# EAGLE design opamp_swing (EAGLE 6.2)
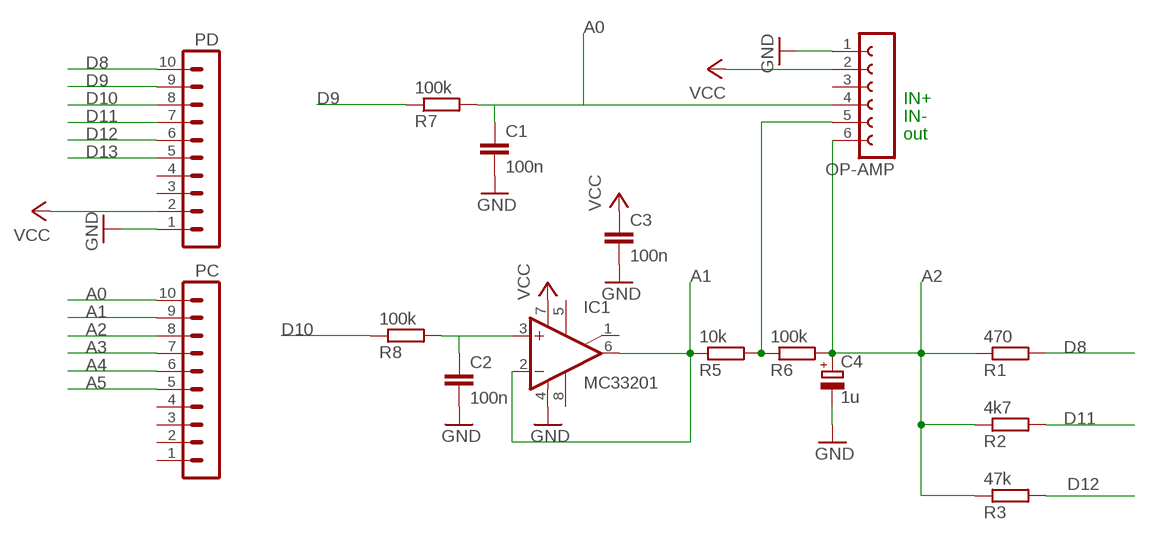
[diagram p0: schematic, sheet 1]

## Parts
C1  100n  C-EU050-025X075  [C050-025X075]
C2  100n  C-EU025-024X044  [C025-024X044]
C3  100n  C-EU025-024X044  [C025-024X044]
C4  1u  CPOL-EU153CLV-0405  [153CLV-0405]
IC1  MC33201  CA3130N  [DIL08]
OP-AMP  FE06W  [FE06W]
PC  MA10-1W  [MA10-1W]
PD  MA10-1W  [MA10-1W]
R1  470  R-EU_R1206  [R1206]
R2  4k7  R-EU_R1206  [R1206]
R3  47k  R-EU_R1206  [R1206]
R5  10k  R-EU_0207/12  [0207/12]
R6  100k  R-EU_0207/2V  [0207/2V]
R7  100k  R-EU_0207/15  [0207/15]
R8  100k  R-EU_0207/15  [0207/15]

## Nets
A0: C1.1 OP-AMP.4 PC.10 R7.2
A1: IC1.2(-IN) IC1.6(OUT) PC.9 R5.1
A2: C4.+ OP-AMP.6 PC.8 R1.1 R2.1 R3.1 R6.2
A3: PC.7
A4: PC.6
A5: PC.5
D8: PD.10 R1.2
D9: PD.9 R7.1
D10: PD.8 R8.1
D11: PD.7 R2.2
D12: PD.6 R3.2
D13: PD.5
GND: C1.2 C2.2 C3.2 C4.- IC1.4(V-) OP-AMP.1 PD.1
N$1: C2.1 IC1.3(+IN) R8.2
N$2: OP-AMP.5 R5.2 R6.1
VCC: C3.1 IC1.7(V+) OP-AMP.2 PD.2
Unconnected: IC1.1(ON/CMP) IC1.5(ON) IC1.8(CMP) OP-AMP.3 PC.1 PC.2 PC.3 PC.4 PD.3 PD.4

## Notes on the sheet
- IN+
- IN-
- out

## Library data of the parts
C1-C3 = rcl:C-EU: CAPACITOR, European symbol
C4 = rcl:CPOL-EU: POLARIZED CAPACITOR, European symbol
IC1 = linear:CA3130: OP AMP
OP-AMP = con-lsta:FE06W: FEMALE HEADER; OC_FARNELL: unknown; OC_NEWARK: unknown
PC PD = con-lstb:MA10-1W: PIN HEADER
R1-R3 R5-R8 = rcl:R-EU_: RESISTOR, European symbol

## Board
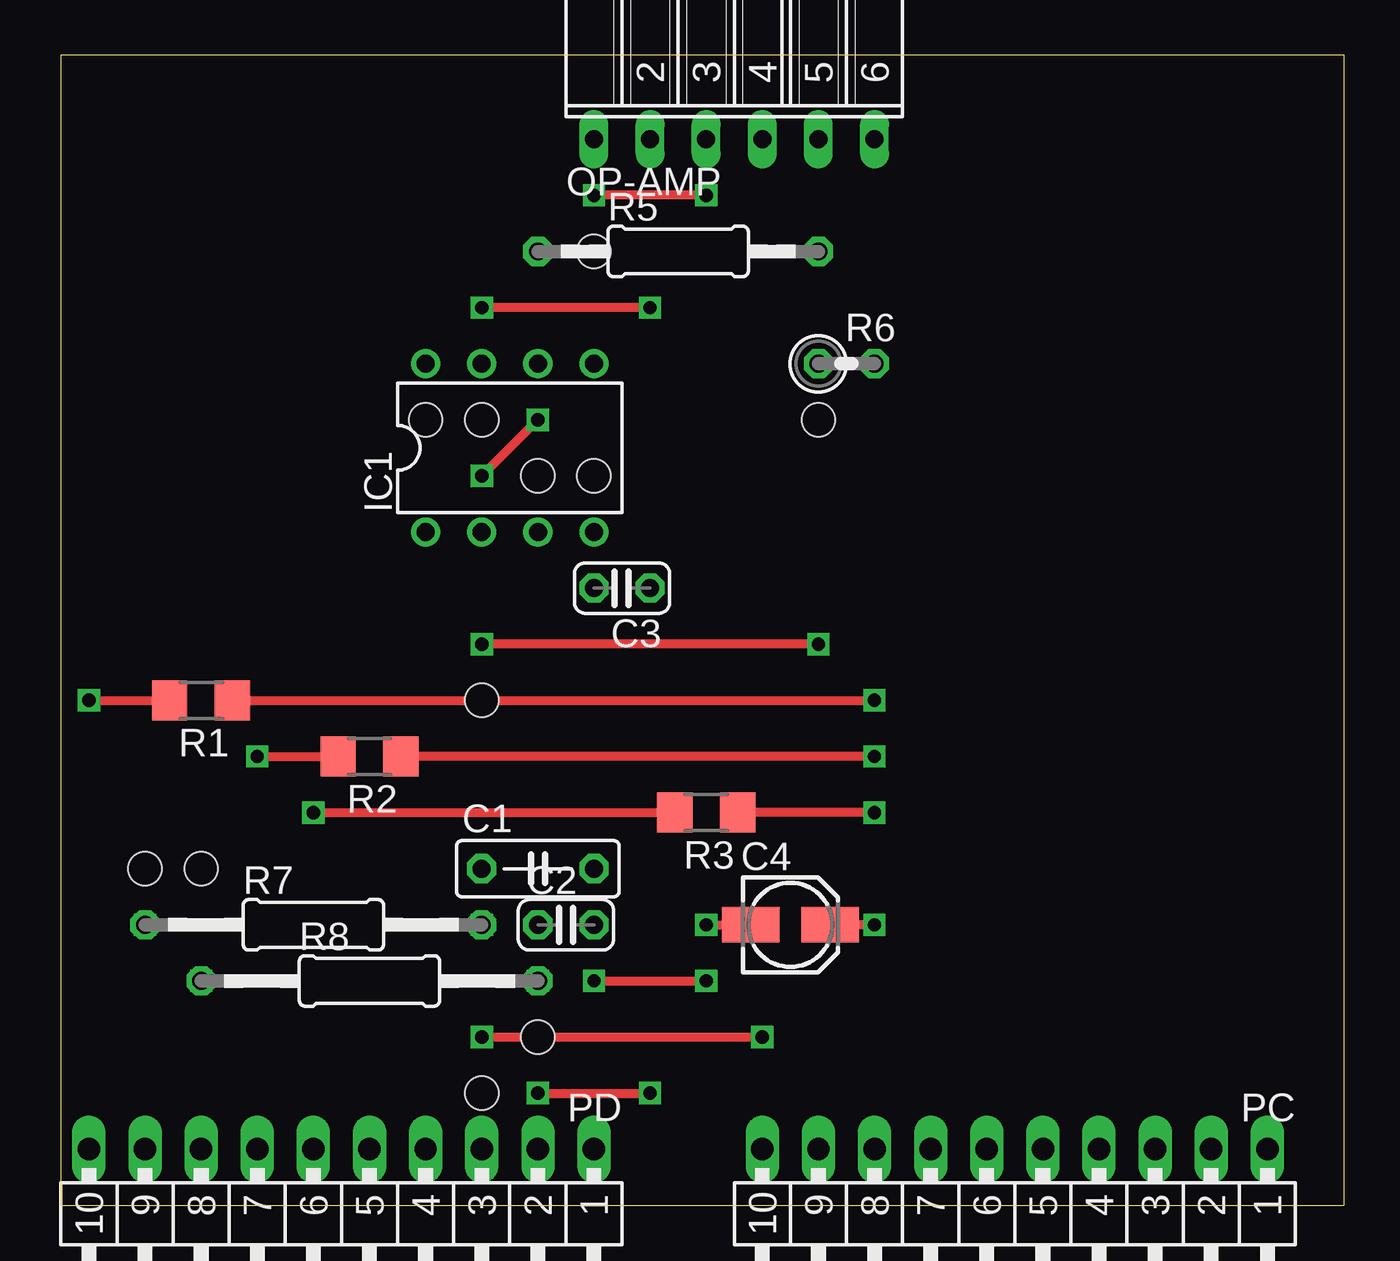
[diagram p1: board, top side]
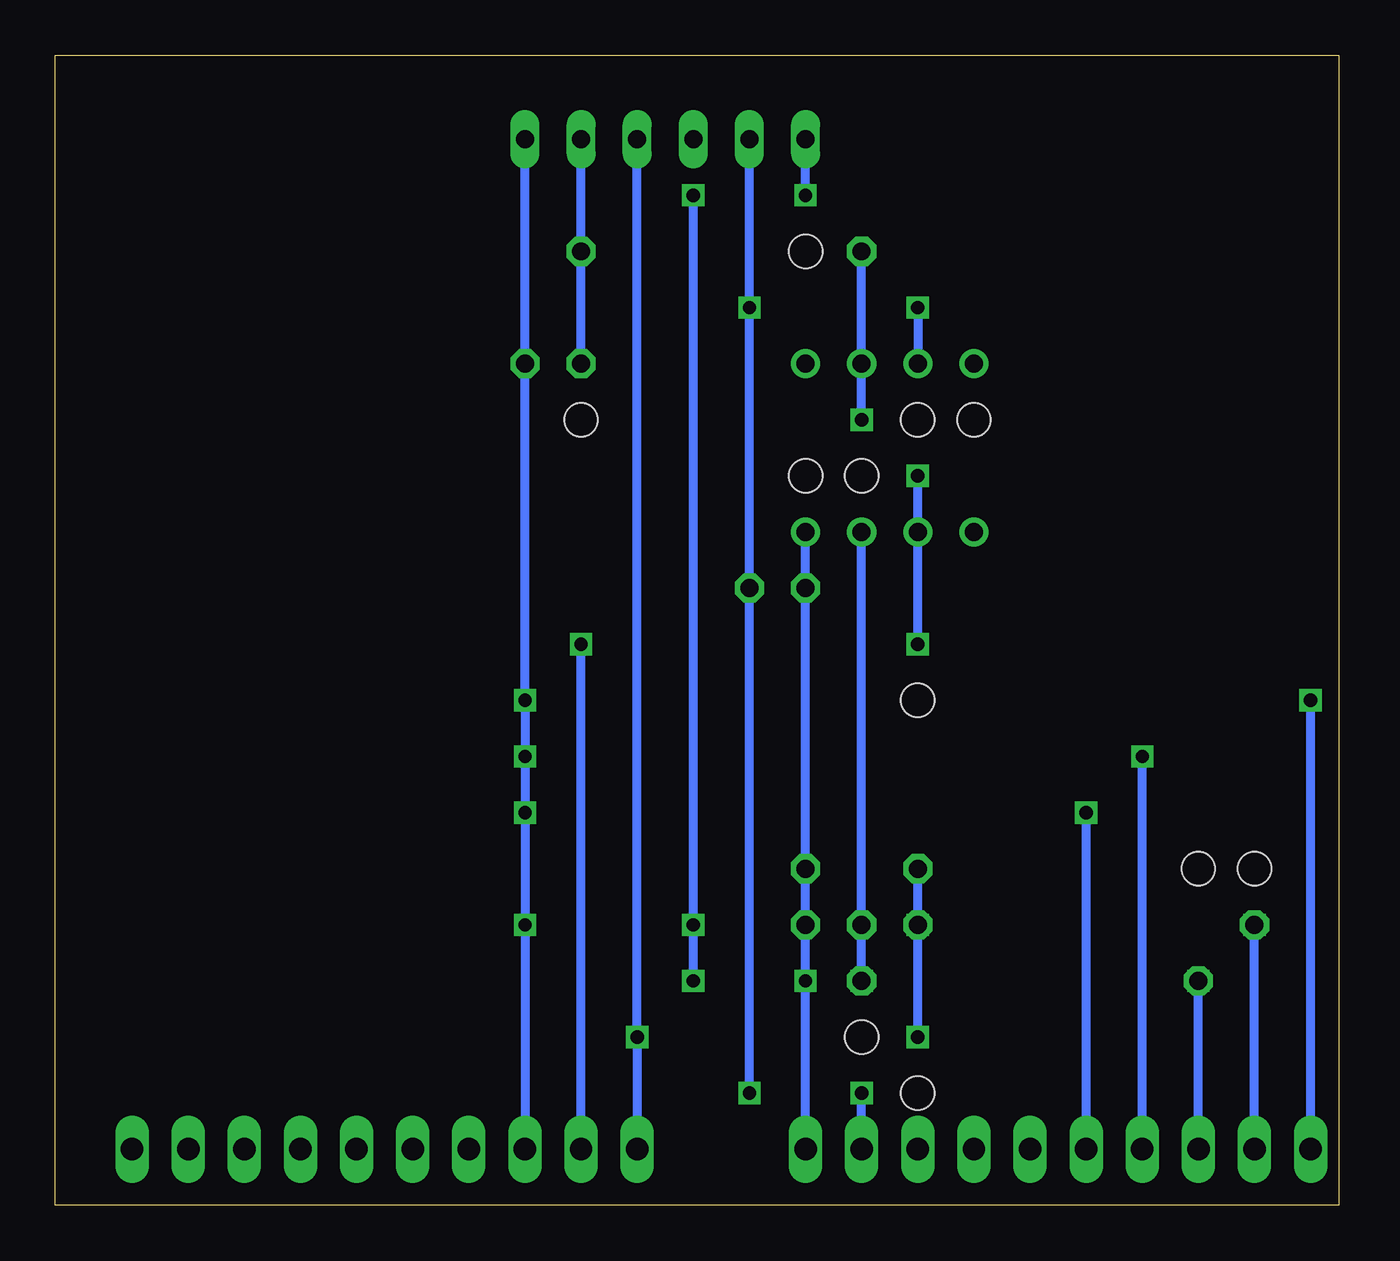
[diagram p2: board, bottom side, seen from below]

Size 58.09 x 52.06 mm. Coordinates in mm from the lower left corner, seen from the top.
Outline: 0,0 58.09,0 58.09,52.06 0,52.06 0,0
Copper layers (1*16): Top 0.035mm / dielectric 1.5mm / Bottom 0.035mm
Design rules: minimum track width 10mil, minimum drill 24mil, track to track 8mil, track to pad 8mil, pad to pad 8mil, via to via 8mil, smd to smd 8mil, copper to edge 40mil, drill to drill 8mil, minimum pad ring 10mil, minimum via ring 8mil, stop-mask expansion 4mil, vias tented up to drill 0mil, thermal gap 10mil
Holes 1.5 mm at 34.29,35.56 19.05,35.56 21.59,33.02 24.13,33.02 16.51,35.56 19.05,22.86 19.05,5.08 21.59,7.62 3.81,15.24 6.35,15.24 24.13,43.18

### Footprints (pad centres in the part's own frame; a part is rotated, then mirrored left to right if it is on the bottom)
C050-025X075 = drill 0.813 octagon: 1 -2.54,0; 2 2.54,0
C025-024X044 = drill 0.813 octagon: 1 -1.27,0; 2 1.27,0
153CLV-0405 = smd 2.6 x 1.6: + 1.8,0; - -1.8,0
DIL08 = drill 0.813 pad 1.27: 1 -3.81,-3.81; 2 -1.27,-3.81; 3 1.27,-3.81; 4 3.81,-3.81; 5 3.81,3.81; 6 1.27,3.81; 7 -1.27,3.81; 8 -3.81,3.81
FE06W = drill 0.813 long: 1 -6.35,0; 2 -3.81,0; 3 -1.27,0; 4 1.27,0; 5 3.81,0; 6 6.35,0
MA10-1W = drill 1.016 long: 1 -11.43,0; 2 -8.89,0; 3 -6.35,0; 4 -3.81,0; 5 -1.27,0; 6 1.27,0; 7 3.81,0; 8 6.35,0; 9 8.89,0; 10 11.43,0
R1206 = smd 1.6 x 1.803: 1 -1.422,0; 2 1.422,0
0207/12 = drill 0.813 octagon: 1 -6.35,0; 2 6.35,0
0207/2V = drill 0.813 octagon: 1 -1.27,0; 2 1.27,0
0207/15 = drill 0.813 octagon: 1 -7.62,0; 2 7.62,0

### Placement (x,y rotation side)
C1  21.59,15.24 0 top
C2  22.86,12.7 0 top
C3  25.4,27.94 180 top
C4  33.02,12.7 0 top
IC1  20.32,34.29 0 top
OP-AMP  30.48,48.26 0 top
PC  43.18,2.54 180 top
PD  12.7,2.54 180 top
R1  6.35,22.86 180 top
R2  13.97,20.32 180 top
R3  29.21,17.78 180 top
R5  27.94,43.18 0 top
R6  35.56,38.1 0 top
R7  11.43,12.7 0 top
R8  13.97,10.16 0 top

### Tracks (layer width: path | path; a pad name or v marks a point on that pad's centre or on a via)
A0  (via drill 0.6)
  Top 0.406: v19.05,7.62 v31.75,7.62
  Bottom 0.406: PC.10 v31.75,7.62 OP-AMP.4 | C1.1 R7.2 v19.05,7.62
  other vias: 19.05,12.7
A1  (via drill 0.6)
  Top 0.406: v34.29,25.4 v19.05,25.4 | v19.05,33.02 v21.59,35.56
  Bottom 0.406: R5.1 IC1.6 v21.59,35.56 | v19.05,25.4 IC1.2 v19.05,33.02 | PC.9 v34.29,25.4
A2  (via drill 0.6)
  Top 0.406: R1.1 v36.83,22.86 | v36.83,17.78 R3.1 | v36.83,20.32 R2.1 | v36.83,12.7 C4.+
  Bottom 0.406: OP-AMP.6 R6.2 v36.83,22.86 v36.83,20.32 v36.83,17.78 v36.83,12.7 PC.8
D8  (via drill 0.6)
  Top 0.406: v1.27,22.86 R1.2
  Bottom 0.406: PD.10 v1.27,22.86
D9  (via drill 0.6)
  Bottom 0.406: PD.9 R7.1
  other vias: 3.81,12.7
D10  (via drill 0.6)
  Bottom 0.406: PD.8 R8.1
  other vias: 6.35,10.16
D11  (via drill 0.6)
  Top 0.406: v8.89,20.32 R2.2
  Bottom 0.406: PD.7 v8.89,20.32
D12  (via drill 0.6)
  Top 0.406: v11.43,17.78 R3.2
  Bottom 0.406: PD.6 v11.43,17.78
GND  (via drill 0.6)
  Top 0.406: v29.21,45.72 v24.13,45.72 | v24.13,10.16 v29.21,10.16 | v29.21,12.7 C4.-
  Bottom 0.406: IC1.4 C3.2 C1.2 C2.2 v24.13,10.16 PD.1 | v24.13,45.72 OP-AMP.1 | v29.21,10.16 v29.21,12.7 v29.21,45.72
N$1  (via drill 0.6)
  Bottom 0.406: IC1.3 C2.1 R8.2
  other vias: 21.59,10.16
N$2
  Bottom 0.406: OP-AMP.5 R6.1 R5.2
VCC  (via drill 0.6)
  Top 0.406: v26.67,40.64 v19.05,40.64 | v21.59,5.08 v26.67,5.08
  Bottom 0.406: v26.67,5.08 C3.1 v26.67,40.64 OP-AMP.2 | v19.05,40.64 IC1.7 | PD.2 v21.59,5.08

### Text on the board
doc_purple: OPAMP RANGE | IN+ | IN- | OUT | GND | VCC